# Altium schematic sheet S7CAS-PLEIADES-CARTE-MERE_P20_Power-Tree-5.SchDoc
size Tabloid; SheetNumber: 19; SheetTotal: 19; Sheet_Name: Insert name in Document Parameters; Size: 11x17
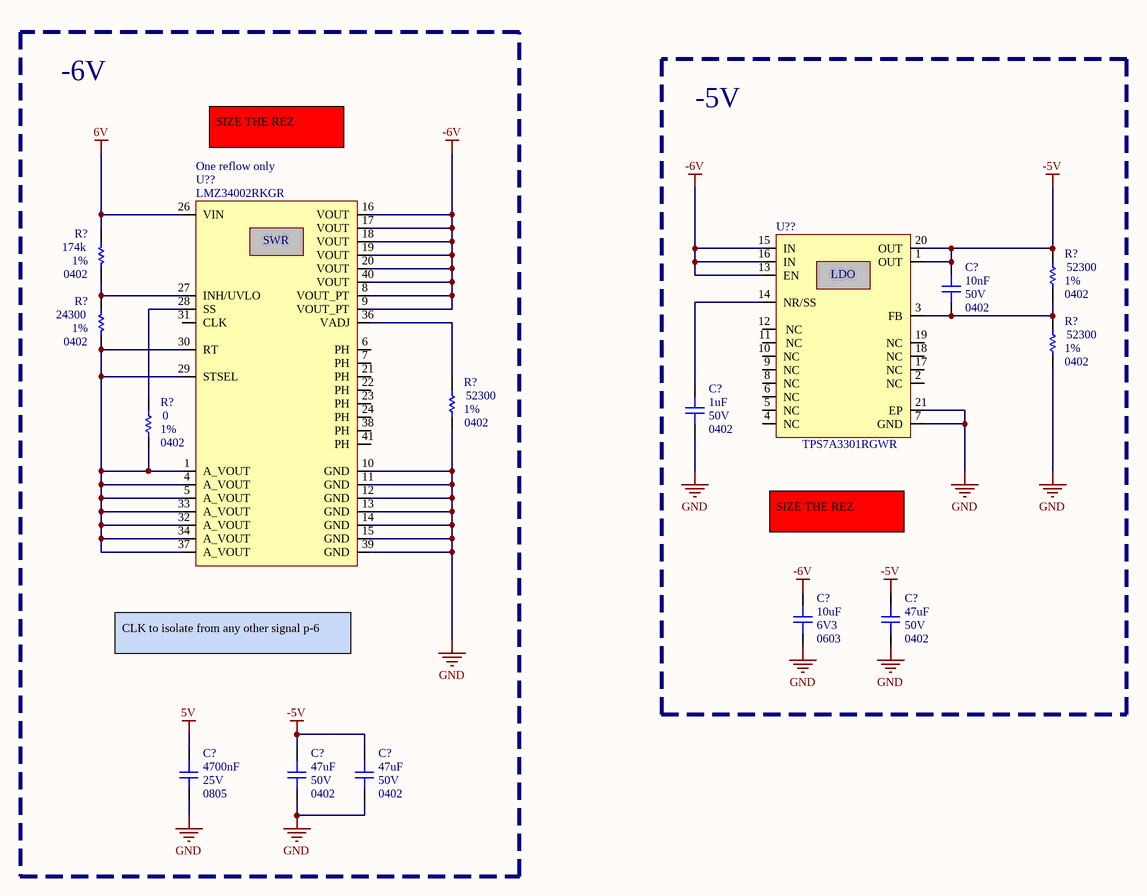
[diagram p0: S7CAS-PLEIADES-CARTE-MERE_P20_Power-Tree-5.SchDoc]

## Parts
(Parts that share a designator on the sheet are numbered #1, #2 ... from top to bottom, then left to right.)
C?#1  value 10nF  Voltage: 50V  Package: 0402  [CAP_0603]  (hidden comment: CAP - 0603)
C?#2  value 1uF  Voltage: 50V  Package: 0402  [CAP_0402]  (hidden comment: CAP - 0402)
C?#3  value 10uF  Voltage: 6V3  Package: 0603  [CAP_0603]  (hidden comment: CAP - 0603)
C?#4  value 47uF  Voltage: 50V  Package: 0402  [CAP_0402]  (hidden comment: CAP - 0402)
C?#5  value 4700nF  Voltage: 25V  Package: 0805  [CAP_0402]  (hidden comment: CAP - 0402)
C?#6  value 47uF  Voltage: 50V  Package: 0402  [CAP_0402]  (hidden comment: CAP - 0402)
C?#7  value 47uF  Voltage: 50V  Package: 0402  [CAP_0402]  (hidden comment: CAP - 0402)
R?#1  value 174k  Package: 0402  Precision: 1%  [RES_0402]  (hidden comment: RES - 0402)
R?#2  value 52300  Package: 0402  Precision: 1%  [RES_0402]  (hidden comment: RES - 0402)
R?#3  value 24300  Package: 0402  Precision: 1%  [RES_0402]  (hidden comment: RES - 0402)
R?#4  value 52300  Package: 0402  Precision: 1%  [RES_0402]  (hidden comment: RES - 0402)
R?#5  value 52300  Package: 0402  Precision: 1%  [RES_0402]  (hidden comment: RES - 0402)
R?#6  value 0  Package: 0402  Precision: 1%  [RES_0402]  (hidden comment: RES - 0402)
U??#1  LMZ34002RKGR  Assembly Note: One reflow only  [REG_SWR_LMZ34002RKGR]
U??#2  TPS7A3301RGWR  [REG_LDO_TPS7A3301RGWR]

## Blocks framed on the sheet
-6V: C?#5-C?#7 R?#1 R?#3 R?#5 R?#6 U??#1
-5V: C?#1-C?#4 R?#2 R?#4 U??#2

## Nets
5V: C?#5.2
6V: R?#1.2 U??#1.26(VIN)
-5V: C?#1.2 C?#4.2 C?#6.2 C?#7.2 R?#2.2 U??#2.1(OUT) U??#2.20(OUT)
-6V: C?#3.2 U??#1.8(VOUT_PT) U??#1.9(VOUT_PT) U??#1.16(VOUT) U??#1.17(VOUT) U??#1.18(VOUT) U??#1.19(VOUT) U??#1.20(VOUT) U??#1.40(VOUT) U??#2.13(EN) U??#2.15(IN) U??#2.16(IN)
GND: C?#2.1 C?#3.1 C?#4.1 C?#5.1 C?#6.1 C?#7.1 R?#4.1 R?#5.1 U??#1.10(GND) U??#1.11(GND) U??#1.12(GND) U??#1.13(GND) U??#1.14(GND) U??#1.15(GND) U??#1.39(GND) U??#2.7(GND) U??#2.21(EP)
NetC?#1_1: C?#1.1 R?#2.1 R?#4.2 U??#2.3(FB)
NetC?#2_2: C?#2.2 U??#2.14(NR/SS)
NetR?#1_1: R?#1.1 R?#3.2 U??#1.27(INH/UVLO)
NetR?#3_1: R?#3.1 R?#6.1 U??#1.1(A_VOUT) U??#1.4(A_VOUT) U??#1.5(A_VOUT) U??#1.29(STSEL) U??#1.30(RT) U??#1.32(A_VOUT) U??#1.33(A_VOUT) U??#1.34(A_VOUT) U??#1.37(A_VOUT)
NetR?#5_2: R?#5.2 U??#1.36(VADJ)
NetR?#6_2: R?#6.2 U??#1.28(SS)

Not connected (* = marked no-connect by the designer): U??#1 2(DNC) 3(DNC) 6(PH) 7(PH) 21(PH) 22(PH) 23(PH) 24(PH) 25(DNC) 31(CLK) 35(DNC) 38(PH) 41(PH); U??#2 2(NC) 4(NC) 5(NC) 6(NC) 8(NC) 9(NC) 10(NC) 11(NC) 12(NC) 17(NC) 18(NC) 19(NC)

## Notes on the sheet
- SIZE THE REZ
- CLK to isolate from any other signal p-6
- Sheet Name
- Project Title
- Global Project
- Size
- Group
- Revision
- Date
- Sheet
- of
- Filename
- Designers
- (in symbol REG_LDO_TPS7A3301RGWR) LDO
- (in symbol REG_SWR_LMZ34002RKGR) SWR

## Library data of the parts
C?#1 = CAP - 0603: Mfg Part Number: GRM155R71H103KA88; Precision: 10%; Current: *; CreatedBy: Jonathan Bouchard; Power: *
C?#2 = CAP - 0402: Precision: 10%; Current: *; CreatedBy: Jonathan Bouchard; Power: *
C?#3 = CAP - 0603: Mfg Part Number: GRM188B30J106ME47; Precision: 10%; Current: *; CreatedBy: Jonathan Bouchard; Power: *
C?#4 C?#6 C?#7 = CAP - 0402: Mfg Part Number: GRT155R71H272KE01; Precision: 10%; Current: *; CreatedBy: Jonathan Bouchard; Power: *
C?#5 = CAP - 0402: Mfg Part Number: GRM219R61E475KA73; Precision: 10%; Current: *; CreatedBy: Jonathan Bouchard; Power: *
R?#1-R?#6 = RES - 0402: Voltage: 50V; Power: 1/16W; Current: *; CreatedBy: Jonathan Bouchard
U??#1 = REG_SWR_LMZ34002RKGR: REG - DC DC Converter -3V to -17V 2A - 41-B1QFN; Manufacturer #1: Texas Instruments; Value: -3 ~ -17V; Voltage Rating: 4.5-40V; Power Max: 15W; GRAMS Lib Spec: 2.8c; Magnetic Material: Unknown; Polarized: Yes; Tolerance: *; Current Rating: 2A; HelpURL: http://www.ti.com/lit/ds/symlink/lmz34002.pdf; CreatedBy/Date: P.Marcoux  20-06-2019; VerifiedBy: C.Paulin - 22/01/2020; Temperature: -40°C ~ 85°C; Package: 41-B1QFN; Manufacturer #2: *; Note: *; Assembly Type: SMD; Part Number #2: *; Part Number #1: LMZ34002RKGR; Supplier 1: Digi-Key; Supplier Part Number 1: 296-44356-1-ND; Cryo: UNKNOWN
U??#2 = REG_LDO_TPS7A3301RGWR: REG - LDO Negative Adjustable 1 Output -1.18V-33V 1A -  20-VQFN (5x5); Manufacturer #1: Texas Instruments; Value: -1.18V~-33V; Voltage Rating: -36V; GRAMS Lib Spec: 2.8; Magnetic Material: Unknown; Polarized: Yes; Tolerance: *; Current Rating: 1A; Power Max: *; HelpURL: http://www.ti.com/lit/ds/symlink/tps7a33.pdf; CreatedBy/Date: Keven Deslandes - 2018/10/11; VerifiedBy: Caroline Paulin - 11/12/2018; Temperature: -40°C ~ 125°C; Package: 20-VQFN; Manufacturer #2: *; Assembly Type: SMD; Part Number #2: *; Part Number #1: TPS7A3301RGWR; Supplier 1: Digi-Key; Supplier Part Number 1: 296-39502-1-ND; Cryo: UNKNOWN